# Altium schematic sheet Whitespace_Daughtercard_ucontroller.SchDoc: Daughtercard Microcontroller
size A3; Author: Ryan E. Guerra; Revision: 1.0; SheetNumber: 5; SheetTotal: 10
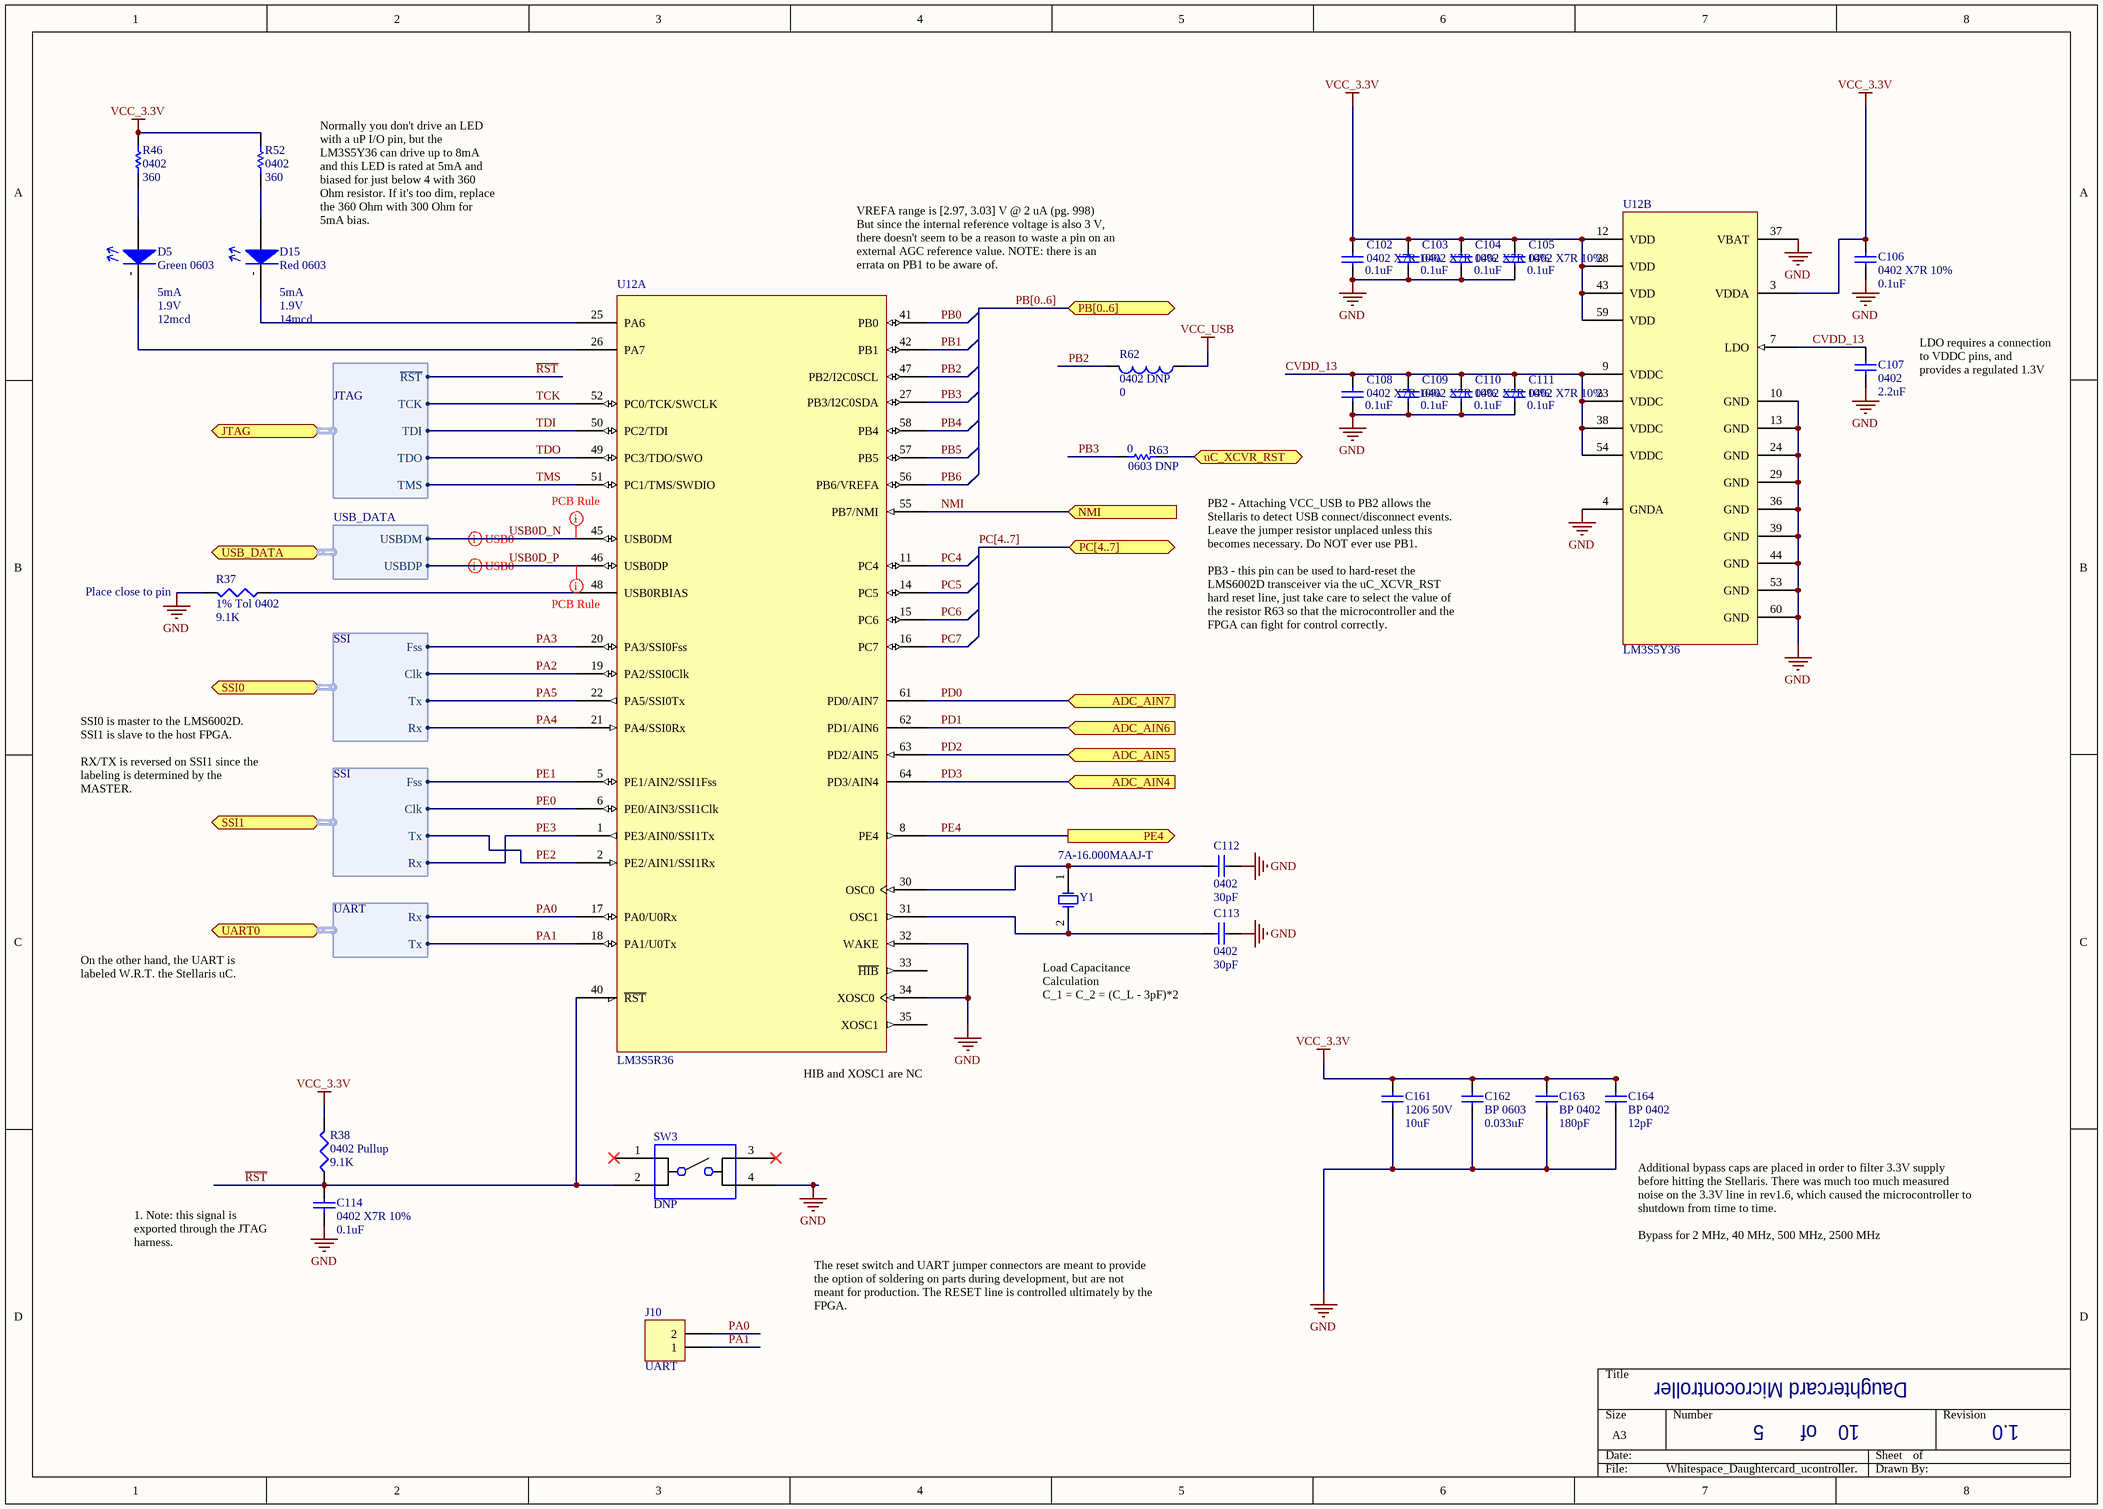
[diagram p0: Whitespace_Daughtercard_ucontroller.SchDoc]

## Parts
C102  0402 X7R 10%  value 0.1uF  [0402_SMT_V3]
C103  0402 X7R 10%  value 0.1uF  [0402_SMT_V3]
C104  0402 X7R 10%  value 0.1uF  [0402_SMT_V3]
C105  0402 X7R 10%  value 0.1uF  [0402_SMT_V3]
C106  0402 X7R 10%  value 0.1uF  [0402_SMT_V3]
C107  0402  value 2.2uF  [0402_SMT_v3]
C108  0402 X7R 10%  value 0.1uF  [0402_SMT_V3]
C109  0402 X7R 10%  value 0.1uF  [0402_SMT_V3]
C110  0402 X7R 10%  value 0.1uF  [0402_SMT_V3]
C111  0402 X7R 10%  value 0.1uF  [0402_SMT_V3]
C112  0402  value 30pF  [0402_SMT_v3]
C113  0402  value 30pF  [0402_SMT_v3]
C114  0402 X7R 10%  value 0.1uF  [0402_SMT_V3]
C161  1206 50V  value 10uF  [1206_SMT_v3]
C162  BP 0603  value 0.033uF  [0603_SMT_v3]
C163  BP 0402  value 180pF  [0402_SMT_v3]
C164  BP 0402  value 12pF  [0402_SMT_v3]
D5  Green 0603  Current: 5mA  Forward Voltage: 1.9V  Luminosity: 12mcd  [0603_POLAR]
D15  Red 0603  Current: 5mA  Forward Voltage Drop: 1.9V  Luminosity: 14mcd  [0603_POLAR]
J10  UART  [HDR1X2]
R37  1% Tol 0402  value 9.1K  [0402_SMT_v3]
R38  0402 Pullup  value 9.1K  [0402_SMT_v3]
R46  0402  value 360  [0402_SMT_v3]
R52  0402  value 360  [0402_SMT_v3]
R62  0402 DNP  value 0  [0402_SMT_V3]
R63  0603 DNP  value 0  [0603_SMT_v3]
SW3  DNP  [PUSHBUTTON_SW2_SMT]
U12  LM3S5R36  [PQFP-64-TI_Stellaris]  (parts A,B of 2)
Y1  7A-16.000MAAJ-T  [XTAL_SMT_5_3-2_v2]

## Ports
ADC_AIN4 (in), ADC_AIN5 (in), ADC_AIN6 (in), ADC_AIN7 (in), JTAG (harness JTAG), NMI (in), PB[0..6], PC[4..7], PE4 (out), SSI0 (harness SSI), SSI1 (harness SSI), UART0 (harness UART), uC_XCVR_RST, USB_DATA (harness USB_DATA)

## Harnesses
JTAG: TCK, TDI, TDO, TMS, ~{RST}
SSI: Fss, Clk, Tx, Rx
UART: Rx, Tx
USB_DATA: USBDM, USBDP

## Nets
GND: C102.1 C103.1 C104.1 C105.1 C106.2 C107.2 C108.1 C109.1 C110.1 C111.1 C112.2 C113.2 C114.2 C161.1 C162.2 C163.2 C164.2 R37.2 SW3.4 U12.4(GNDA) U12.10(GND) U12.13(GND) U12.24(GND) U12.29(GND) U12.32(WAKE) U12.34(XOSC0) U12.36(GND) U12.37(VBAT) U12.39(GND) U12.44(GND) U12.53(GND) U12.60(GND)
VCC_3.3V: C102.2 C103.2 C104.2 C105.2 C106.1 C161.2 C162.1 C163.1 C164.1 R38.2 R46.2 R52.2 U12.3(VDDA) U12.12(VDD) U12.28(VDD) U12.43(VDD) U12.59(VDD)
VCC_USB: R62.1
~{RST}: C114.1 R38.1 SW3.2 U12.40(~{RST}) ; port JTAG.~{RST}
CVDD_13: C107.1 C108.2 C109.2 C110.2 C111.2 U12.7(LDO) U12.9(VDDC) U12.23(VDDC) U12.38(VDDC) U12.54(VDDC)
NMI: U12.55(PB7/NMI) ; port NMI
PA0: J10.2 U12.17(PA0/U0Rx) ; port UART0.Rx
PA1: J10.1 U12.18(PA1/U0Tx) ; port UART0.Tx
PA2: U12.19(PA2/SSI0Clk) ; port SSI0.Clk
PA3: U12.20(PA3/SSI0Fss) ; port SSI0.Fss
PA4: U12.21(PA4/SSI0Rx) ; port SSI0.Rx
PA5: U12.22(PA5/SSI0Tx) ; port SSI0.Tx
PB0: U12.41(PB0)
PB1: U12.42(PB1)
PB2: R62.2 U12.47(PB2/I2C0SCL)
PB3: R63.2 U12.27(PB3/I2C0SDA)
PB4: U12.58(PB4)
PB5: U12.57(PB5)
PB6: U12.56(PB6/VREFA)
PC4: U12.11(PC4)
PC5: U12.14(PC5)
PC6: U12.15(PC6)
PC7: U12.16(PC7)
PD0: U12.61(PD0/AIN7) ; port ADC_AIN7
PD1: U12.62(PD1/AIN6) ; port ADC_AIN6
PD2: U12.63(PD2/AIN5) ; port ADC_AIN5
PD3: U12.64(PD3/AIN4) ; port ADC_AIN4
PE0: U12.6(PE0/AIN3/SSI1Clk) ; port SSI1.Clk
PE1: U12.5(PE1/AIN2/SSI1Fss) ; port SSI1.Fss
PE2: U12.2(PE2/AIN1/SSI1Rx) ; port SSI1.Tx
PE3: U12.1(PE3/AIN0/SSI1Tx) ; port SSI1.Rx
PE4: U12.8(PE4) ; port PE4
TCK: U12.52(PC0/TCK/SWCLK) ; port JTAG.TCK
TDI: U12.50(PC2/TDI) ; port JTAG.TDI
TDO: U12.49(PC3/TDO/SWO) ; port JTAG.TDO
TMS: U12.51(PC1/TMS/SWDIO) ; port JTAG.TMS
uC_XCVR_RST: R63.1 ; port uC_XCVR_RST
USB0D_N: U12.45(USB0DM) ; port USB_DATA.USBDM
USB0D_P: U12.46(USB0DP) ; port USB_DATA.USBDP
NetC112_1: C112.1 U12.30(OSC0) Y1.1(OSC1)
NetC113_1: C113.1 U12.31(OSC1) Y1.2(OSC2)
NetD5_+: D5.+(Anode) R46.1
NetD5_-: D5.-(Cathode) U12.26(PA7)
NetD15_+: D15.+(Anode) R52.1
NetD15_-: D15.-(Cathode) U12.25(PA6)
NetR37_1: R37.1 U12.48(USB0RBIAS)

Not connected (* = marked no-connect by the designer): SW3 1* 3*; U12 33(~{HIB}) 35(XOSC1)

## Buses and harness runs
bus PB[0..6] = port PB[0..6]
bus PC[4..7] = port PC[4..7]

## Layout directives
differential pair: USB0D_N, USB0D_P
rule Impedance Constraint [Min = 49.00    Max = 51.00    ]: USB0D_N, USB0D_P

## Notes on the sheet
- Normally you don't drive an LED with a uP I/O pin, but the LM3S5Y36 can drive up to 8mA and this LED is rated at 5mA and biased for just below 4 with 360 Ohm resistor. If it's too dim, replace the 360 Ohm with 300 Ohm for 5mA bias.
- (near U12) VREFA range is [2.97, 3.03] V @ 2 uA (pg. 998)
  But since the internal reference voltage is also 3 V, there doesn't seem to be a reason to waste a pin on an external AGC reference value. NOTE: there is an errata on PB1 to be aware of.
- (near C107) LDO requires a connection to VDDC pins, and provides a regulated 1.3V
- (near R37) Place close to pin
- PB2 - Attaching VCC_USB to PB2 allows the Stellaris to detect USB connect/disconnect events. Leave the jumper resistor unplaced unless this becomes necessary. Do NOT ever use PB1.
  PB3 - this pin can be used to hard-reset the LMS6002D transceiver via the uC_XCVR_RST hard reset line, just take care to select the value of the resistor R63 so that the microcontroller and the FPGA can fight for control correctly.
- SSI0 is master to the LMS6002D.
  SSI1 is slave to the host FPGA.
  RX/TX is reversed on SSI1 since the labeling is determined by the MASTER.
- On the other hand, the UART is labeled W.R.T. the Stellaris uC.
- Load Capacitance Calculation
  C_1 = C_2 = (C_L - 3pF)*2
  (TI spma036 pg. 6)
- (near U12) HIB and XOSC1 are NC
- 1. Note: this signal is exported through the JTAG harness.
- Additional bypass caps are placed in order to filter 3.3V supply before hitting the Stellaris. There was much too much measured noise on the 3.3V line in rev1.6, which caused the microcontroller to shutdown from time to time.
  Bypass for 2 MHz, 40 MHz, 500 MHz, 2500 MHz
- The reset switch and UART jumper connectors are meant to provide the option of soldering on parts during development, but are not meant for production. The RESET line is controlled ultimately by the FPGA.
- of

## Library data of the parts
C102-C106 C108-C111 C114 C161-C164 = Cap: Capacitor; Published: 8-Jun-2000; LatestRevisionDate: 17-Jul-2002; LatestRevisionNote: Re-released for DXP Platform.; PackageReference: RAD-0.3; Publisher: Altium Limited; PackageDescription: Radial Cap, Thru-Hole; 2 Leads; 0.3 in Pin Spacing; Supplier 1: Mouser
  C102-C106 C108-C111 C114: Supplier Part Number 1: 810-C1005X7R1H104K
  C161: Supplier Part Number 1: 81-GRM31CR61H106KA2L
  C162: Supplier Part Number 1: 81-GRM188R71H333KA61
  C163: Supplier Part Number 1: 81-GRM1555C1H181GA1D
  C164: Supplier Part Number 1: 81-GRM1555C1H120GA1D
C107 C112 C113 = Cap Semi: Capacitor (Semiconductor SIM Model); Published: 8-Jun-2000; LatestRevisionDate: 29-May-2009; LatestRevisionNote: IPC-7351 Footprint Added.; PackageReference: C1206; Publisher: Altium Limited; PackageDescription: Chip Capacitor; Supplier 1: Mouser
  C107: Supplier Part Number 1: 81-GRM36X222K50
  C112 C113: Supplier Part Number 1: 81-GRM1555C1H300FA1J
D5 D15 = LED: Supplier 1: Mouser
  D5: Supplier Part Number 1: 859-LTSTC193KGKT5A
  D15: Supplier Part Number 1: 859-LTSTC193KRKT5A
J10 = Header 2: Header, 2-Pin; LatestRevisionDate: 17-Jul-2002; LatestRevisionNote: Re-released for DXP Platform.; Publisher: Altium Limited
R37 R38 = Res3: Resistor; Published: 8-Jun-2000; LatestRevisionDate: 29-May-2009; LatestRevisionNote: IPC-7351 Footprint Added.; PackageReference: J1-0603; Publisher: Altium Limited; PackageDescription: Chip Resistor; Supplier 1: Mouser; Supplier Part Number 1: 660-RK73H1ETTP9101F
R46 R52 R63 = Res Semi: Semiconductor Resistor; Published: 8-Jun-2000; LatestRevisionDate: 17-Jul-2002; LatestRevisionNote: Re-released for DXP Platform.; PackageReference: AXIAL-0.5; Publisher: Altium Limited; PackageDescription: Axial Device, Thru-Hole; 2 Leads; 0.5 in Pin Spacing; Supplier 1: Mouser
  R46 R52: Supplier Part Number 1: 660-RK73B1ETTP361J
  R63: Supplier Part Number 1: 660-RK73Z1JTTDD
R62 = Inductor: Code_IEC: 1005; Published: 8-Jun-2000; LatestRevisionDate: 29-May-2009; LatestRevisionNote: IPC-7351 Footprint Added.; PackageReference: 0402-A; Publisher: Altium Limited; PackageDescription: Chip Inductor; Code_JEITA: 0402; Supplier 1: Mouser; Supplier Part Number 1: 660-RK73Z1ETTP
SW3 = SMT-PUSHBUTTON-SW: Pushbutton Switch - Long Button
U12 = LM3S5Y36: TI Stellaris LM3S5Y36 Microcontroller; Supplier 1: Mouser; Supplier Part Number 1: 595-LM3S5R36-IQR80C5
Y1 = XTAL: Crystal Oscillator; Published: 8-Jun-2000; LatestRevisionDate: 17-Jul-2002; LatestRevisionNote: Re-released for DXP Platform.; PackageReference: R38; Publisher: Altium Limited; PackageDescription: Crystal, Thru-Hole; 2 Leads; Body 3.1 x 8.2 mm (Dia.xH); Supplier 1: Mouser; Supplier Part Number 1: 717-7A-16.000MAAJ-T